# EAGLE design PCB3 (EAGLE 9.6.2)
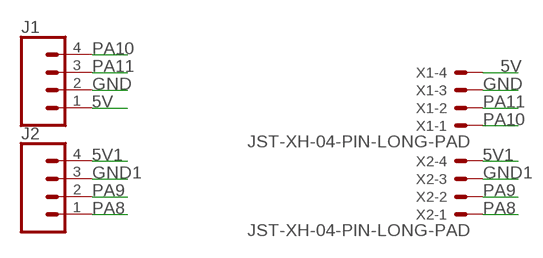
[diagram p0: schematic, sheet 1]

## Parts
J1  CONN_04  [1X04]
J2  CONN_04  [1X04]
X1  JST-XH-04-PIN-LONG-PAD  [JST-XH-04-PACKAGE-LONG-PAD]
X2  JST-XH-04-PIN-LONG-PAD  [JST-XH-04-PACKAGE-LONG-PAD]

## Nets
5V: J1.1 X1.4
5V1: J2.4 X2.4
GND: J1.2 X1.3
GND1: J2.3 X2.3
PA8: J2.1 X2.1
PA9: J2.2 X2.2
PA10: J1.4 X1.1
PA11: J1.3 X1.2

## Library data of the parts
J1 J2 = SparkFun-Connectors:CONN_04: Multi connection point. Often used as Generic Header-pin footprint for 0.1 inch spaced/style header connections On any of the 0.1 inch spaced packages, you can populate with these: Break Away Headers - Straight <https://www.sparkfun.com/products/116> (PRT-00116) Break Away Male Headers - Right Angle <https://www.sparkfun.com/products/553> (PRT-00553) Female Headers <https://www.sparkfun.com/products/115> (PRT-00115) Break Away Headers - Machine Pin <https://www.sparkfun.com/products/117> (PRT-00117) Break Away Female Headers - Swiss Machine Pin <https://www.sparkfun.com/products/743> (PRT-00743) For SCREWTERMINALS and SPRING TERMINALS visit here: Screw Terimnals on SparkFun.com <https://www.sparkfun.com/search/results?term=Screw+Terminals> (5mm/3.5mm/2.54mm spacing) This device is also useful as a general connection point to wire up your design to another part of your project. Our various solder wires solder well into these plated through hole pads. Hook-Up Wire - Assortment (Stranded, 22 AWG) <https://www.sparkfun.com/products/11375> (PRT-11375) Hook-Up Wire - Assortment (Solid Core, 22 AWG) <https://www.sparkfun.com/products/11367> (PRT-11367) View the entire wire category on our website here <https://www.sparkfun.com/categories/141> Special notes: Molex polarized connector foot print use with SKU : PRT-08231 with associated crimp pins and housings. 1MM SMD Version SKU: PRT-10208; PROD_ID: CONN-09696
X1 X2 = Rembrandt Electronics - JST XH Connectors v1-0:JST-XH-04-PIN: JST XH Connector 2 Pin Wire to board connector. Pitch: 2,54 mm, (0.100") Number of pins: 4 Created by Rembrandt Electronics www.rembrandtelectronics.com

## Board
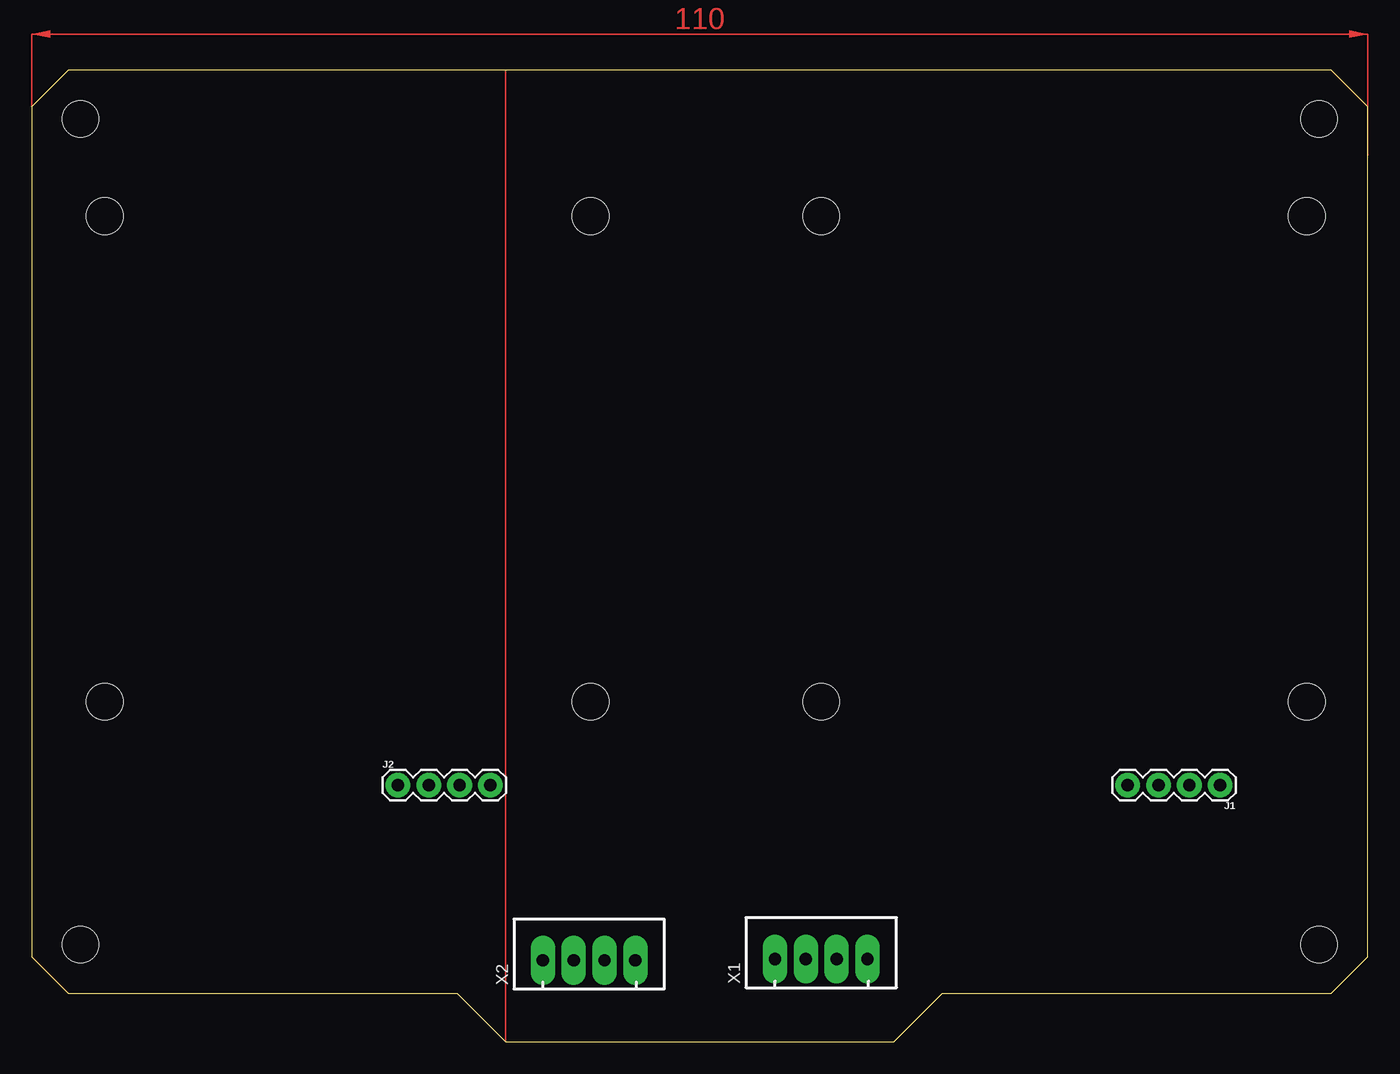
[diagram p1: board, top side]
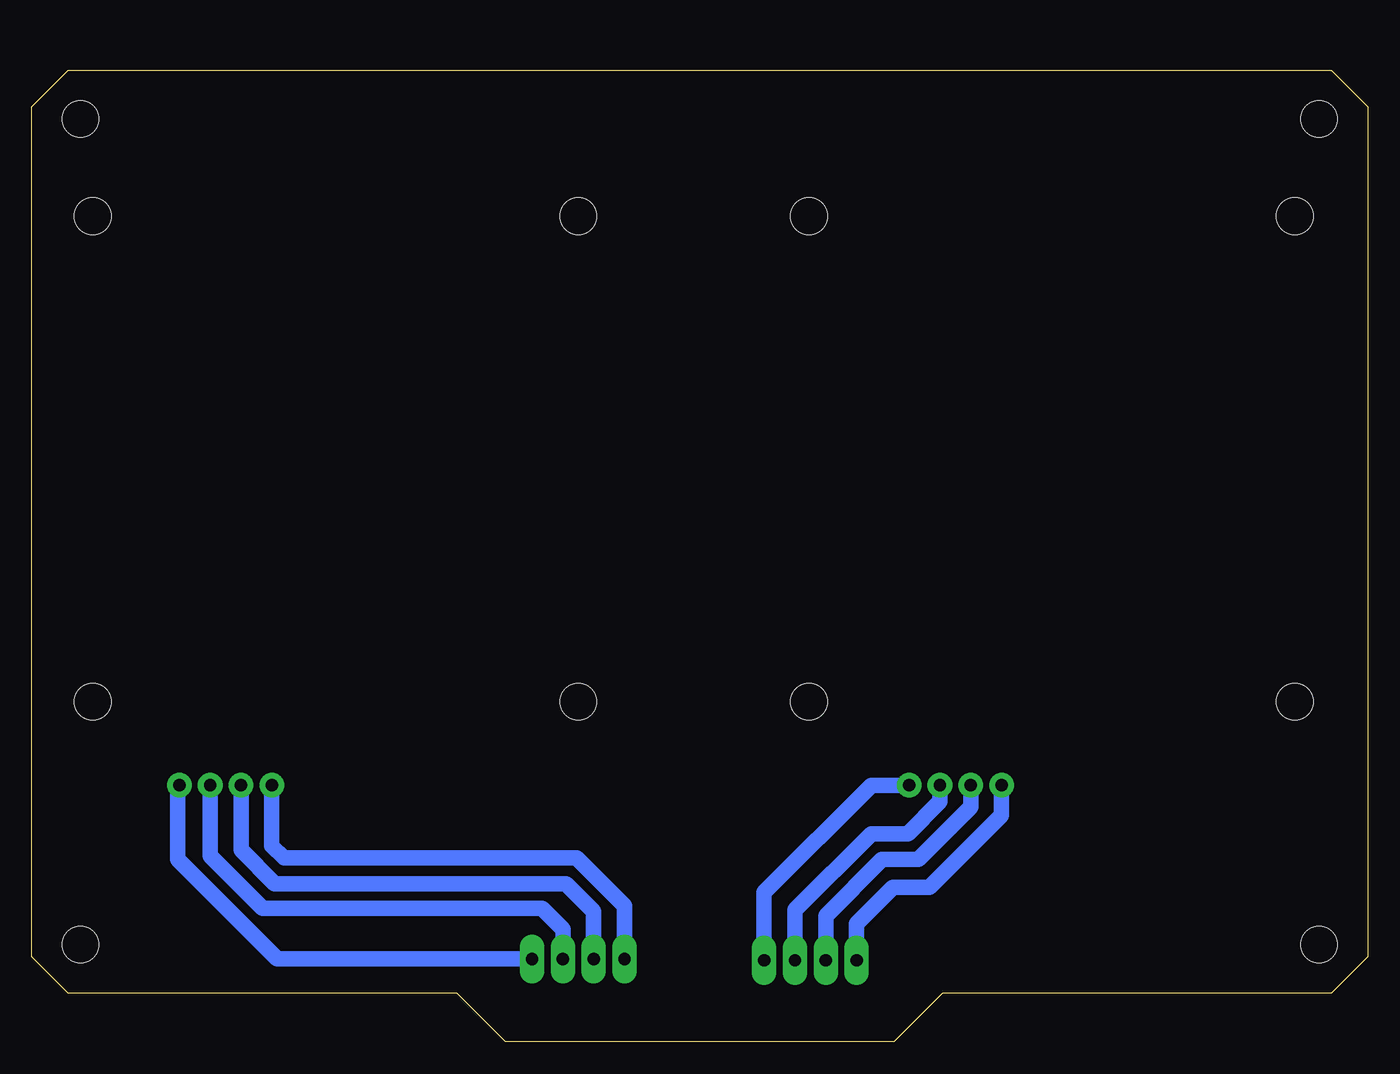
[diagram p2: board, bottom side, seen from below]

Size 110 x 80 mm. Coordinates in mm from the lower left corner, seen from the top.
Outline: 0,77 0,7 3,4 35,4 39,0 71,0 75,4 107,4 110,7 110,77 107,80 3,80 0,77
Copper layers (1*16): Top 0.035mm / dielectric 1.5mm / Bottom 0.035mm
Design rules "default *": minimum track width 6mil, minimum drill 0.35mm, track to track 6mil, track to pad 6mil, pad to pad 6mil, via to via 6mil, smd to smd 6mil, copper to edge 40mil, drill to drill 6mil, minimum pad ring 20mil, minimum via ring 12mil, stop-mask expansion 4mil, vias tented up to drill 0mil, thermal gap 10mil
Holes 3 mm at 6,28 46,28 46,68 6,68 65,28 105,28 105,68 65,68 4,76 106,76 106,8 4,8

### Footprints (pad centres in the part's own frame; a part is rotated, then mirrored left to right if it is on the bottom)
1X04 = drill 1.016 pad 1.88: 1 0,0; 2 2.54,0; 3 5.08,0; 4 7.62,0
JST-XH-04-PACKAGE-LONG-PAD = drill 1.016 long: 1 -3.81,0; 2 -1.27,0; 3 1.27,0; 4 3.81,0

### Placement (x,y rotation side)
J1  97.86,21.13 180 top
J2  30.14,21.13 0 top
X1  65,6.81 0 top
X2  45.89,6.7 0 top

### Tracks (layer width: path | path; a pad name or v marks a point on that pad's centre or on a via)
5V
  Bottom 1.27: X1.4 89.81,6.81 98,15 98,20.99 J1.1
5V1
  Bottom 1.27: X2.4 49.7,12.3 40.87,21.13 J2.4
GND
  Bottom 1.27: X1.3 66.27,9.27 68,11 91,11 95.32,15.32 J1.2
GND1
  Bottom 1.27: X2.3 47.16,10.84 40.87,17.13 37.87,17.13 35.22,19.78 J2.3
PA8
  Bottom 1.27: X2.1 42.08,9.7 39.08,12.7 36.08,12.7 30.14,18.64 J2.1
PA9
  Bottom 1.27: X2.2 44.62,10.38 40,15 37,15 32.68,19.32 J2.2
PA10
  Bottom 1.27: X1.1 61.19,11.19 65.13,15.13 89.24,15.13 90.24,16.13 J1.4
PA11
  Bottom 1.27: X1.2 63.73,10.73 66,13 90,13 92.78,15.78 J1.3
(copper drawn outside any net)
  shapes: Top area x2